# Altium schematic sheet Sheet1.SchDoc
size A2; Author: Juan Pablo Vargas; SheetNumber: 1; SheetTotal: 1
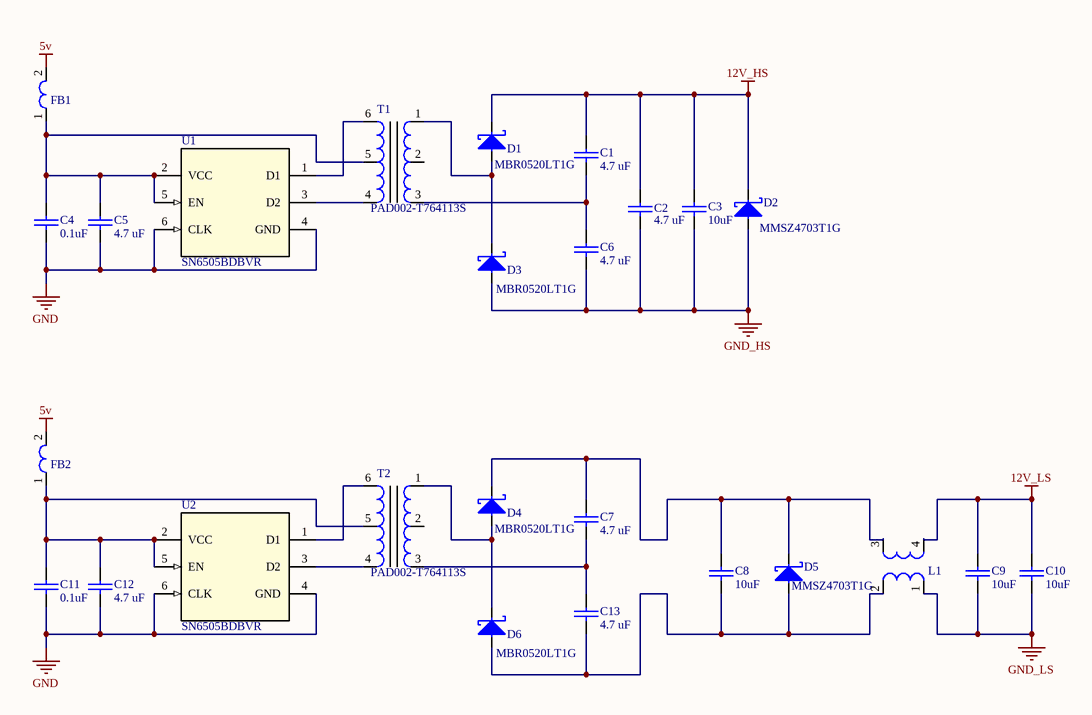
[diagram p0: Sheet1.SchDoc]

## Parts
C1  4.7 uF  [0603_cap]
C2  4.7 uF  [0603_cap]
C3  value 10uF  [0805_cap]  (hidden comment: 10uF 25V)
C4  value 0.1uF  [0603_cap]  (hidden comment: 0.1uF 50V)
C5  4.7 uF  [0603_cap]
C6  4.7 uF  [0603_cap]
C7  4.7 uF  [0603_cap]
C8  value 10uF  [0805_cap]  (hidden comment: 10uF 25V)
C9  value 10uF  [0805_cap]  (hidden comment: 10uF 25V)
C10  value 10uF  [0805_cap]  (hidden comment: 10uF 25V)
C11  value 0.1uF  [0603_cap]  (hidden comment: 0.1uF 50V)
C12  4.7 uF  [0603_cap]
C13  4.7 uF  [0603_cap]
D1  Manufacturer Part Number: MBR0520LT1G  [SOD-123_ONS]  (hidden comment: DIODE_SCHOTTKY_20V)
D2  Manufacturer Part Number: MMSZ4703T1G  [SOD-123_ONS]  (hidden comment: DIODE_ZENER_16V)
D3  Manufacturer Part Number: MBR0520LT1G  [SOD-123_ONS]  (hidden comment: DIODE_SCHOTTKY_20V)
D4  Manufacturer Part Number: MBR0520LT1G  [SOD-123_ONS]  (hidden comment: DIODE_SCHOTTKY_20V)
D5  Manufacturer Part Number: MMSZ4703T1G  [SOD-123_ONS]  (hidden comment: DIODE_ZENER_16V)
D6  Manufacturer Part Number: MBR0520LT1G  [SOD-123_ONS]  (hidden comment: DIODE_SCHOTTKY_20V)
FB1  FERRITE_BEAD_600_OHM  [MH1608]  (value not drawn)
FB2  FERRITE_BEAD_600_OHM  [MH1608]  (value not drawn)
L1  CMC_300MA_2LN_360_OHM_SMD  [SRF2012-361YA]  (value not drawn)
T1  PAD002-T764113S  [PAD002-T764113S]
T2  PAD002-T764113S  [PAD002-T764113S]
U1  SN6505BDBVR  [IC TRANSFORMER DRIVER 6SOT-23]
U2  SN6505BDBVR  [IC TRANSFORMER DRIVER 6SOT-23]

## Nets
5v: FB1.2 FB2.2
12V_HS: C1.1 C2.1 C3.1 D1.1 D2.1
12V_LS: C9.1 C10.1 L1.4
GND: C4.2 C5.2 C11.2 C12.2 U1.4(GND) U1.6(CLK) U2.4(GND) U2.6(CLK)
GND_HS: C2.2 C3.2 C6.2 D2.2 D3.2
GND_LS: C9.2 C10.2 L1.1
NetC1_2: C1.2 C6.1 T1.3
NetC4_1: C4.1 C5.1 FB1.1 T1.5 U1.2(VCC) U1.5(EN)
NetC7_1: C7.1 C8.1 D4.1 D5.1 L1.3
NetC7_2: C7.2 C13.1 T2.3
NetC8_2: C8.2 C13.2 D5.2 D6.2 L1.2
NetC11_1: C11.1 C12.1 FB2.1 T2.5 U2.2(VCC) U2.5(EN)
NetD1_2: D1.2 D3.1 T1.1
NetD4_2: D4.2 D6.1 T2.1
NetT1_4: T1.4 U1.3(D2)
NetT1_6: T1.6 U1.1(D1)
NetT2_4: T2.4 U2.3(D2)
NetT2_6: T2.6 U2.1(D1)

Not connected (* = marked no-connect by the designer): T1 2; T2 2

## Library data of the parts
C1 C2 C5-C7 C12 C13 = CAP_4.7UF_25V_0603: CAP CER 4.7UF 25V X5R 0603; Manufacturer: Murata Electronics; Manufacturer Part Number: GRM188R61E475KE11D; ComponentLink1Description: DigiKEy; ComponentLink1URL: https://www.digikey.com/es/products/detail/murata-electronics/GRM188R61E475KE11D/3900465; Supplier 1: DigiKey; Supplier Part Number 1: 490-7203-1-ND
C3 C8-C10 = Cap_10uF_0805_25V_: 25V 10uF X5R ±10% 0805 Multilayer Ceramic Capacitors MLCC - SMD/SMT ROHS; Manufacturer: Samsung Electro-Mechanics; Manufacturer Part Number: CL21A106KAYNNNE; Supplier 1: LCSC; Supplier Part Number 1: C15850; ComponentLink1Description: LCSC; ComponentLink1URL: https://lcsc.com/product-detail/Multilayer-Ceramic-Capacitors-MLCC-SMD-SMT_Samsung-Electro-Mechanics-CL21A106KAYNNNE_C15850.html
C4 C11 = Cap_0.1uF_0603_50V: 50V 100nF Y5V -20%~+80% 0603 Multilayer Ceramic Capacitors MLCC - SMD/SMT ROHS; Manufacturer: Walsin Tech Corp; Manufacturer Part Number: 0603F104Z500CT; Supplier 1: LCSC; Supplier Part Number 1: C83060; ComponentLink1Description: LCSC; ComponentLink1URL: https://www.lcsc.com/product-detail/Multilayer-Ceramic-Capacitors-MLCC-SMD-SMT_Walsin-Tech-Corp-0603F104Z500CT_C83060.html
D1 D3 D4 D6 = DIODE_SCHOTTKY_20V: DIODE SCHOTTKY 20V 500MA SOD123; Manufacturer: onsemi; Supplier 1: DigiKey; Supplier Part Number 1: DigiKey; ComponentLink1Description: DigiKey; ComponentLink1URL: https://www.digikey.com/es/products/detail/onsemi/MBR0520LT1G/918574?s=N4IgTCBcDaILICEBKAGArGFAZAKgRgHEQBdAXyA
D2 D5 = DIODE_ZENER_16V: DIODE ZENER 16V 500MW SOD123; Manufacturer: onsemi; ComponentLink1Description: DigiKEy; ComponentLink1URL: https://www.digikey.com/es/products/detail/bourns-inc/PAD002-T764113S/15297652?s=N4IgTCBcDaIAoEEAiAGFYC0AVA7ANgBYBGIgZgGUQBdAXyA; Supplier 1: DigiKey; Supplier Part Number 1: MMSZ4703T1GOSCT-ND
FB1 FB2 = FERRITE_BEAD_600_OHM: FERRITE BEAD 600 OHM 0603 4LN; Manufacturer: Bourns Inc.; Manufacturer Part Number: MH1608-601Y; ComponentLink1Description: DigiKEy; ComponentLink1URL: https://www.digikey.com/en/products/detail/bourns-inc/MH1608-601Y/2563317; Supplier 1: DigiKey; Supplier Part Number 1: MH1608-601YCT-ND
L1 = CMC_300MA_2LN_360_OHM_SMD: 2 Obturador de modo común de línea Montaje en superficie 360 Ohms @ 100 MHz 300mA DCR 500mOhm; Manufacturer: Bourns Inc.; ComponentLink1Description: DigiKEy; ComponentLink1URL: https://www.digikey.com/es/products/detail/bourns-inc/SRF2012-361YA/2681268?s=N4IgTCBcDaIMoCUBiYAMBGMBaAzANnQE0BBEAXQF8g; Supplier 1: DigiKey; Supplier Part Number 1: SRF2012-361YACT-ND; Manufacturer Part Number: SRF2012-361YA
T1 T2 = TRANSFORMER_SMPS_XFMR_FWD: XFMR FWD P-P DC/DC CONV 475UH SM; Manufacturer: Bourns Inc.; ComponentLink1Description: DigiKEy; ComponentLink1URL: https://www.digikey.com/es/products/detail/bourns-inc/PAD002-T764113S/15297652?s=N4IgTCBcDaIAoEEAiAGFYC0AVA7ANgBYBGIgZgGUQBdAXyA; Supplier 1: DigiKey; Supplier Part Number 1: 118-PAD002-T764113SCT-ND; Manufacturer Part Number: PAD002-T764113S
U1 U2 = IC_TRANSFORMER_DRIVER_6SOT-23: IC TRANSFORMER DRIVER 6SOT-23; Manufacturer: Texas Instruments; ComponentLink1Description: DigiKey; ComponentLink1URL: https://www.digikey.com/es/products/detail/texas-instruments/SN6505BDBVR/5994596?s=N4IgTCBcDaIMoDkBsBWADCgQgEUwNQCUQBdAXyA; Supplier 1: DigiKey; Manufacturer Part Number: SN6505BDBVR; Supplier Part Number 1: 296-47311-1-ND